# EAGLE design fju project (EAGLE 9.4.2)
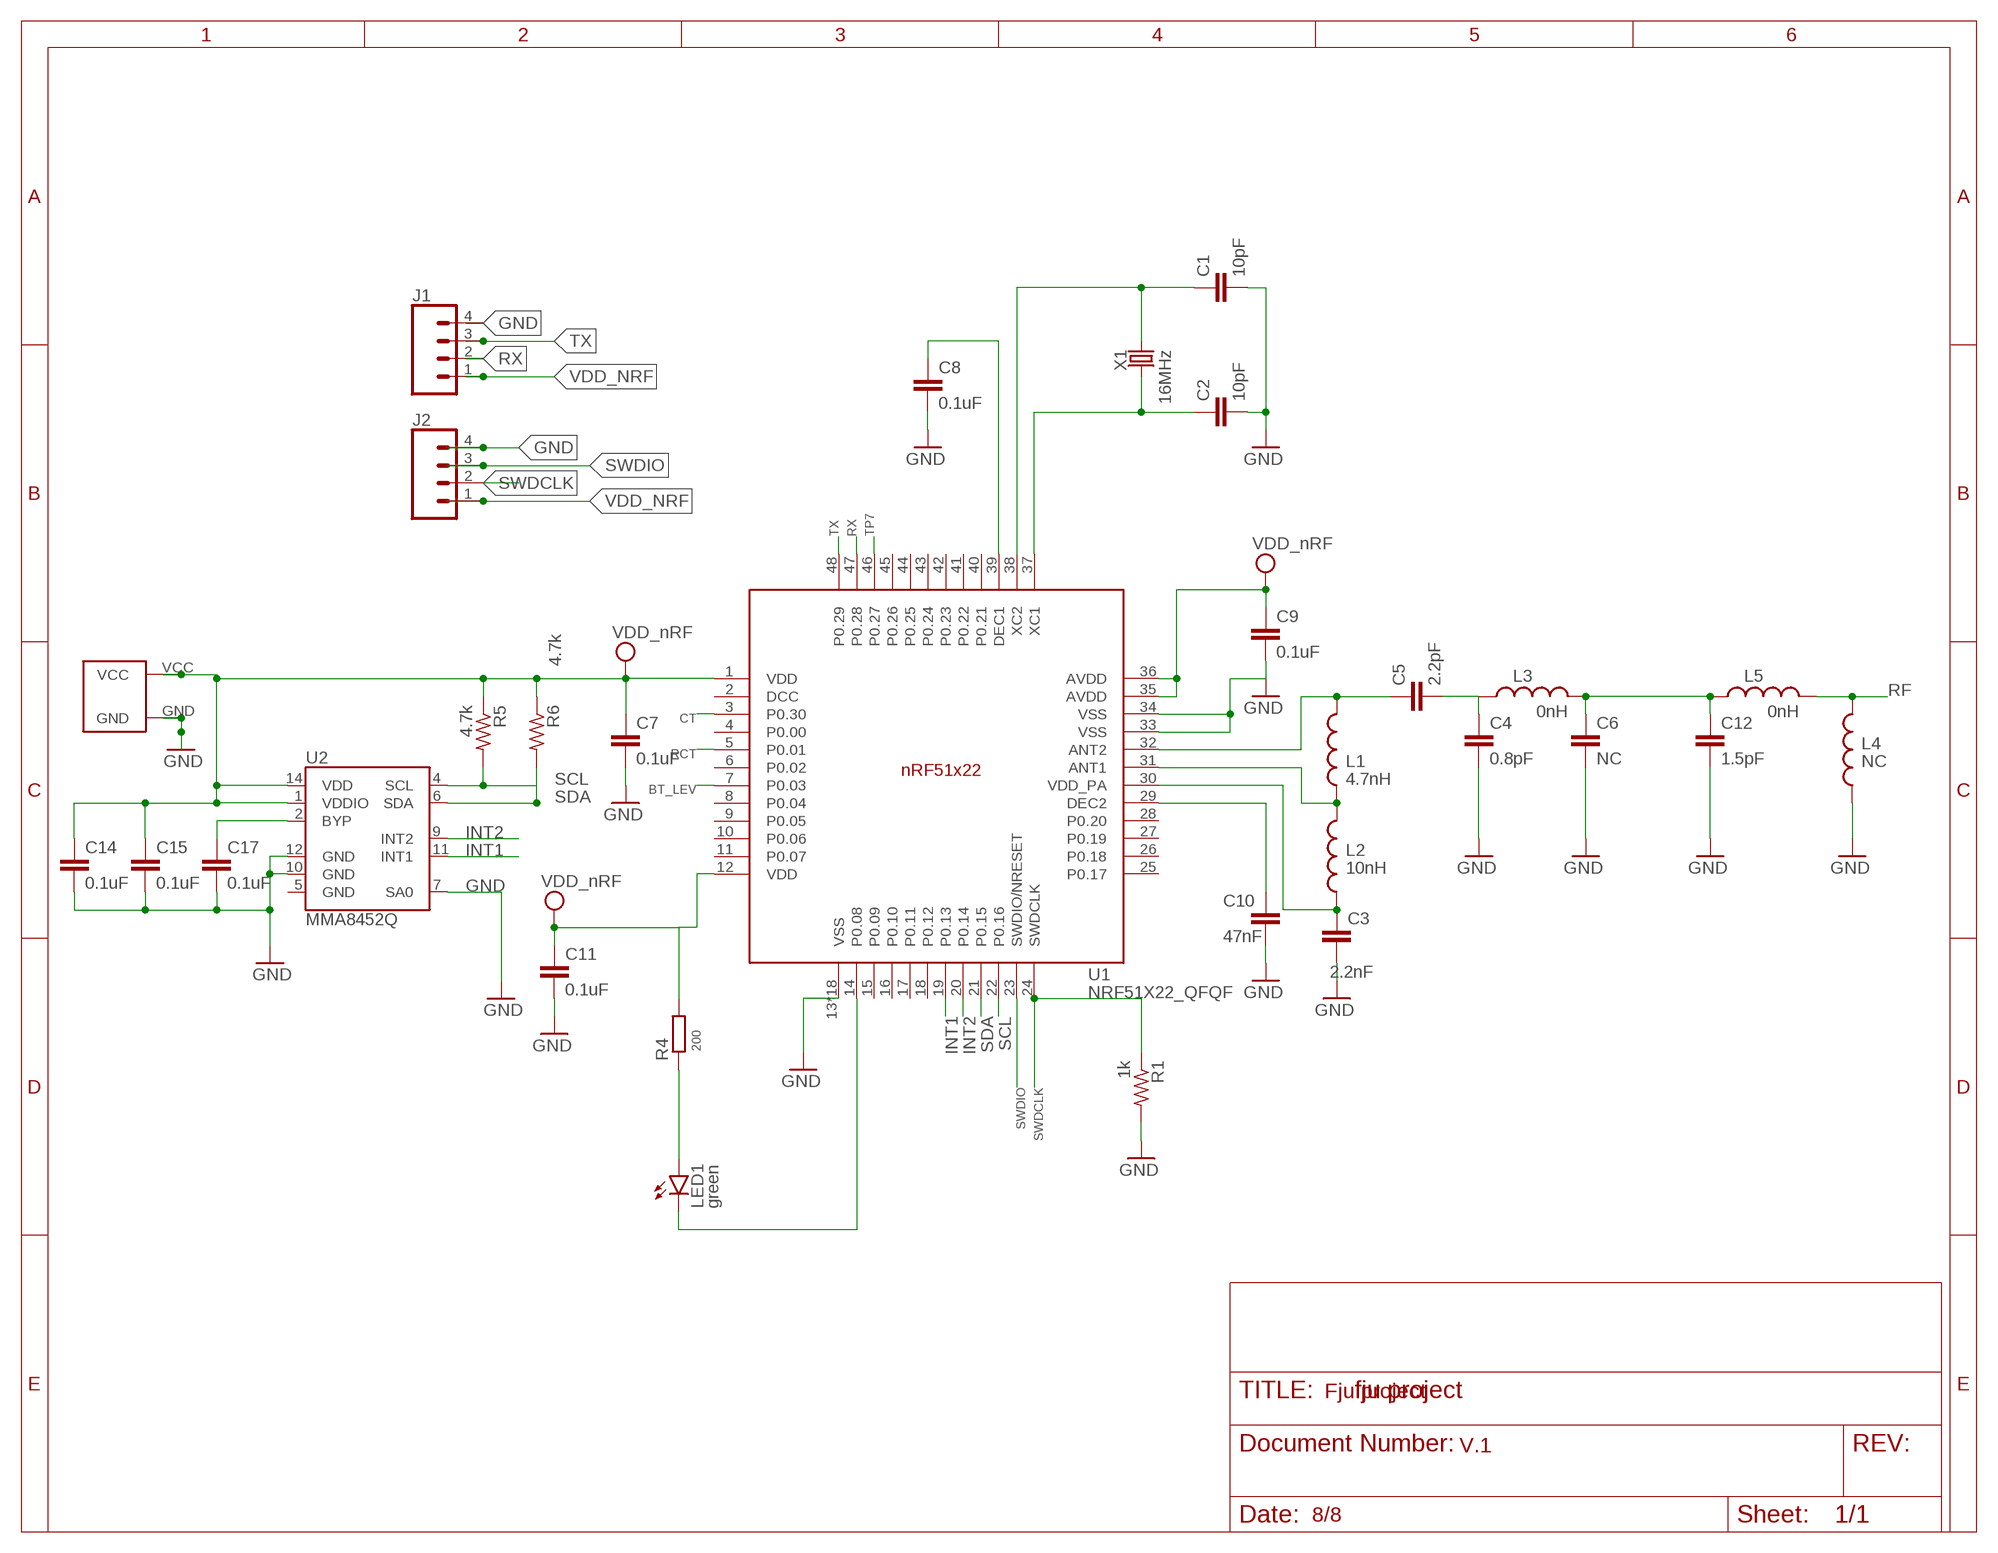
[diagram p0: schematic, sheet 1]

## Parts
C1  10pF  CAPACITOR_0402_N  [RESC0402_N]
C2  10pF  CAPACITOR_0402_N  [RESC0402_N]
C3  2.2nF  CAPACITOR_0402_N  [RESC0402_N]
C4  0.8pF  CAPACITOR_0402_N  [RESC0402_N]
C5  2.2pF  CAPACITOR_0402_N  [RESC0402_N]
C6  NC  CAPACITOR_0402_N  [RESC0402_N]
C7  0.1uF  CAPACITOR_0402_N  [RESC0402_N]
C8  0.1uF  CAPACITOR_0402_N  [RESC0402_N]
C9  0.1uF  CAPACITOR_0402_N  [RESC0402_N]
C10  47nF  CAPACITOR_0402_N  [RESC0402_N]
C11  0.1uF  CAPACITOR_0402_N  [RESC0402_N]
C12  1.5pF  CAPACITOR_0402_N  [RESC0402_N]
C14  0.1uF  CAPACITOR_0402_N  [RESC0402_N]
C15  0.1uF  CAPACITOR_0402_N  [RESC0402_N]
C17  0.1uF  CAPACITOR_0402_N  [RESC0402_N]
J1  CONN_04  [1X04]
J2  CONN_04  [1X04]
L1  4.7nH  INDUCTOR_0402_N  [RESC0402_N]
L2  10nH  INDUCTOR_0402_N  [RESC0402_N]
L3  0nH  INDUCTOR_0402_N  [RESC0402_N]
L4  NC  INDUCTOR_0402_N  [RESC0402_N]
L5  0nH  INDUCTOR_0402_N  [RESC0402_N]
LED1  green  LEDSML0603  [SML0603]
R1  1k  R-US_R0402  [R0402]
R4  200  RESISTOR_0402_N  [RESC0402_N]
R5  4.7k  R-US_R0402  [R0402]
R6  4.7k  R-US_R0402  [R0402]
U1  NRF51X22_QFQF  [QFN40P600X600X90-48_N]
U2  MMA8452Q  [QFN-16_0.5MM]
U$1  CR2032  [CR2032-20MM]
X1  16MHz  KX-6  [2.5X2.0_KX-6]

## Nets
BT_LEV: U1.7(P0.03)
BYP: C17.1 U2.2(BYP)
CT: U1.3(P0.30)
GND: C1.2 C2.2 C3.2 C4.2 C6.2 C7.2 C8.2 C9.2 C10.2 C11.2 C12.2 C14.2 C15.2 C17.2 J1.4 J2.4 L4.1 R1.2 U1.13(VSS) U1.33(VSS) U1.34(VSS) U1.PAD(VSS) U1.PAD@VIA01(VSS) U1.PAD@VIA02(VSS) U1.PAD@VIA03(VSS) U1.PAD@VIA04(VSS) U1.PAD@VIA05(VSS) U1.PAD@VIA06(VSS) U1.PAD@VIA07(VSS) U1.PAD@VIA08(VSS) U1.PAD@VIA09(VSS) U1.PAD@VIA10(VSS) U1.PAD@VIA11(VSS) U1.PAD@VIA12(VSS) U1.PAD@VIA13(VSS) U1.PAD@VIA14(VSS) U1.PAD@VIA15(VSS) U1.PAD@VIA16(VSS) U2.7(SA0) U2.10(GND) U2.12(GND) U$1.GND
INT1: U1.19(P0.13) U2.11(INT1)
INT2: U1.20(P0.14) U2.9(INT2)
N$1: L1.1 L2.2 U1.31(ANT1)
N$2: LED1.A R4.1
N$3: C1.1 U1.38(XC2) X1.1
N$4: C4.1 C5.2 L3.1
N$5: C10.1 U1.29(DEC2)
N$6: C8.1 U1.39(DEC1)
N$7: C3.1 L2.1 U1.30(VDD_PA)
N$9: C5.1 L1.2 U1.32(ANT2)
N$10: C6.1 C12.1 L3.2 L5.1
P0.08: LED1.C U1.14(P0.08)
P0.18: U1.46(P0.27)
RCT: U1.5(P0.01)
RF: L4.2 L5.2
RX: J1.2 U1.47(P0.28)
SCL: R5.2 U1.22(P0.16) U2.4(SCL)
SDA: R6.2 U1.21(P0.15) U2.6(SDA)
SWDCLK: J2.2 R1.1 U1.24(SWDCLK)
SWDIO: J2.3 U1.23(SWDIO/NRESET)
TX: J1.3 U1.48(P0.29)
VDD_NRF: C7.1 C9.1 C11.1 C14.1 C15.1 J1.1 J2.1 R4.2 R5.1 R6.1 U1.1(VDD) U1.12(VDD) U1.35(AVDD) U1.36(AVDD) U2.1(VDDIO) U2.14(VDD) U$1.VCC ; supply symbol labelled VDD_nRF
X1: C2.1 U1.37(XC1) X1.3
Unconnected: U1.4(P0.00) U1.6(P0.02) U1.8(P0.04) U1.9(P0.05) U1.10(P0.06) U1.11(P0.07) U1.15(P0.09) U1.16(P0.10) U1.17(P0.11) U1.18(P0.12) U1.25(P0.17) U1.26(P0.18) U1.27(P0.19) U1.28(P0.20) U1.40(P0.21) U1.41(P0.22) U1.42(P0.23) U1.43(P0.24) U1.44(P0.25) U1.45(P0.26) U2.5(GND)

## Notes on the sheet
- Fju project
- V.1
- 8/8

## Power pins joined to a net without a drawn wire
DCC: U1.2(DCC)

## Library data of the parts
C1-C12 C14 C15 C17 = Nordic_nRF:CAPACITOR: Generic chip capacitor; OC_FARNELL: unknown
J1 J2 = SparkFun-Connectors:CONN_04: Multi connection point. Often used as Generic Header-pin footprint for 0.1 inch spaced/style header connections On any of the 0.1 inch spaced packages, you can populate with these: Break Away Headers - Straight <https://www.sparkfun.com/products/116> (PRT-00116) Break Away Male Headers - Right Angle <https://www.sparkfun.com/products/553> (PRT-00553) Female Headers <https://www.sparkfun.com/products/115> (PRT-00115) Break Away Headers - Machine Pin <https://www.sparkfun.com/products/117> (PRT-00117) Break Away Female Headers - Swiss Machine Pin <https://www.sparkfun.com/products/743> (PRT-00743) For SCREWTERMINALS and SPRING TERMINALS visit here: Screw Terimnals on SparkFun.com <https://www.sparkfun.com/search/results?term=Screw+Terminals> (5mm/3.5mm/2.54mm spacing) This device is also useful as a general connection point to wire up your design to another part of your project. Our various solder wires solder well into these plated through hole pads. Hook-Up Wire - Assortment (Stranded, 22 AWG) <https://www.sparkfun.com/products/11375> (PRT-11375) Hook-Up Wire - Assortment (Solid Core, 22 AWG) <https://www.sparkfun.com/products/11367> (PRT-11367) View the entire wire category on our website here <https://www.sparkfun.com/categories/141> Special notes: Molex polarized connector foot print use with SKU : PRT-08231 with associated crimp pins and housings. 1MM SMD Version SKU: PRT-10208; PROD_ID: CONN-09696
L1 = Nordic_nRF:INDUCTOR: Generic chip inductor; MF: BOURNS; MPN: CE201210-4N7J.; OC_FARNELL: 2821535; OC_NEWARK: unknown
L2-L5 = Nordic_nRF:INDUCTOR: Generic chip inductor; OC_FARNELL: unknown; OC_NEWARK: unknown
LED1 = led:LED: LED OSRAM: - CHIPLED LG R971, LG N971, LY N971, LG Q971, LY Q971, LO R971, LY R971 LH N974, LH R974 LS Q976, LO Q976, LY Q976 LO Q996 - Hyper CHIPLED LW Q18S LB Q993, LB Q99A, LB R99A - SideLED LS A670, LO A670, LY A670, LG A670, LP A670 LB A673, LV A673, LT A673, LW A673 LH A674 LY A675 LS A676, LA A676, LO A676, LY A676, LW A676 LS A679, LY A679, LG A679 - Hyper Micro SIDELED® LS Y876, LA Y876, LO Y876, LY Y876 LT Y87S - SmartLED LW L88C, LW L88S LB L89C, LB L89S, LG L890 LS L89K, LO L89K, LY L89K LS L896, LA L896, LO L896, LY L896 - TOPLED LS T670, LO T670, LY T670, LG T670, LP T670 LSG T670, LSP T670, LSY T670, LOP T670, LYG T670 LG T671, LOG T671, LSG T671 LB T673, LV T673, LT T673, LW T673 LH T674 LS T676, LA T676, LO T676, LY T676, LB T676, LH T676, LSB T676, LW T676 LB T67C, LV T67C, LT T67C, LS T67K, LO T67K, LY T67K, LW E67C LS E67B, LA E67B, LO E67B, LY E67B, LB E67C, LV E67C, LT E67C LW T67C LS T679, LY T679, LG T679 LS T770, LO T770, LY T770, LG T770, LP T770 LB T773, LV T773, LT T773, LW T773 LH T774 LS E675, LA E675, LY E675, LS T675 LS T776, LA T776, LO T776, LY T776, LB T776 LHGB T686 LT T68C, LB T68C - Hyper Mini TOPLED® LB M676 - Mini TOPLED Santana® LG M470 LS M47K, LO M47K, LY M47K Source: http://www.osram.convergy.de LUXEON: - LUMILED® LXK2-PW12-R00, LXK2-PW12-S00, LXK2-PW14-U00, LXK2-PW14-V00 LXK2-PM12-R00, LXK2-PM12-S00, LXK2-PM14-U00 LXK2-PE12-Q00, LXK2-PE12-R00, LXK2-PE12-S00, LXK2-PE14-T00, LXK2-PE14-U00 LXK2-PB12-K00, LXK2-PB12-L00, LXK2-PB12-M00, LXK2-PB14-N00, LXK2-PB14-P00, LXK2-PB14-Q00 LXK2-PR12-L00, LXK2-PR12-M00, LXK2-PR14-Q00, LXK2-PR14-R00 LXK2-PD12-Q00, LXK2-PD12-R00, LXK2-PD12-S00 LXK2-PH12-R00, LXK2-PH12-S00 LXK2-PL12-P00, LXK2-PL12-Q00, LXK2-PL12-R00 Source: www.luxeon.com KINGBRIGHT: KA-3528ASYC Source: www.kingbright.com; OC_FARNELL: unknown; OC_NEWARK: unknown
R1 R5 R6 = rcl:R-US_: RESISTOR, American symbol; OC_FARNELL: unknown; SPICEPREFIX: R
R4 = Nordic_misc:RESISTOR: Generic chip resistor
U1 = Nordic_nRF:NRF51X22_QF: nRF51x22 For devices: nRF51422 nRF51822 Features Single chip, highly flexible, 2.4 GHz multi-protocol device 32-bit ARM Cortex M0 CPU core 256kB/128kB flash + 32kB/16kB RAM Supports Bluetooth low energy protocol stacks Thread safe and run-time protected Event driven API On air compatible with nRF24L series 3 data rates (2Mbps/1Mbps/250kbps) +4dBm output power -93dBm sensitivity, Bluetooth low energy PPI system for maximum power-efficient applications and code simplification Flexible power management system with automatic power management of each peripheral Configurable I/O mapping for analog and digital I/O Applications Mobile phone accessories Wearables Beacons Rezence wireless charging monitoring PC peripherals Consumer Electronics (CE) remote controls Proximity/Alert sensors Smart Home Sports, fitness and healthcare sensors Smart RF tags Toys and electronic games Intelligent domestic appliances Industrial and commercial sensors Lighting; OC_FARNELL: unknown; OC_NEWARK: unknown
U2 = SparkFun:MMA8452Q: MMA8452Q 3-Axis, 12/8-bit Digital Accelerometer Supply Voltage: 1.6-3.6V Range: +/- 2g, 4g, 8g Interface: I2C, 12-bit and 8-bit ODR: 1.56 Hz - 800 Hz Package: QFN-16 http://cache.freescale.com/files/sensors/doc/data_sheet/MMA8452Q.pdf; OC_FARNELL: unknown; OC_NEWARK: unknown
U$1 = cr2032v2:CR2032
X1 = crystal-geyer_V1_0:KX: Quartz Crystals (MHz) SMD: KX - Serie Model Size l/w/h [mm] Frequency Range Frequency Stability Temp. Range [°C] Load Capacitance AECQ 200 availabel Datasheet KX-4 KX-5 KX-6 KX-7 KX-9A KX-9B KX-12A KX-12B KX-13 KX-20 KX-K KX-KS 1.6/1.2/0.3 2.0/1.6/0.45 2.5/2.0/0.55 3.2/2.5/0.8 5.0/3.2/1.0 5.0/3.2/1.1 6.0/3.5/1.1 6.0/3.5/1.0 7.0/5.0 /1.3 11.6/5.5/1.6 12.3/4.5/4.2 12.3/4.5/3.2 24.0 ~ 80.0 MHz 16.0 ~ 80.0 MHz 12.0 ~ 80.0 MHz 8.0 ~ 60.0 MHz 7,68 ~ 300,0 MHz 8,0 ~ 50,0 MHz 8,0 ~ 150,0 MHz 8,0 ~ 50,0 MHz 6,0 ~ 160,0 MHz 3,579 ~ 25,0 MHz 3,579 ~ 70,0 MHz 3,579 ~ 70,0 MHz ±10 … ±50ppm ±10 … ±50ppm ±10 … ±50ppm ±10 … ±50ppm ±10 … ±50ppm ±10 … ±50ppm ±10 … ±50ppm ±10 … ±50ppm ±10 … ±50ppm ±50ppm ±10 … ±50ppm ±10 … ±50ppm (*) -40°C …+85°C (*) -40°C …+125°C (*) -40°C …+125°C (*) -40°C …+125°C (*) -40°C …+105°C (*) -40°C …+105°C (*) -40°C …+125°C (*) -40°C …+105°C (*) -40°C …+105°C (*) -40°C …+105°C (*) -40°C …+85°C (*) -40°C …+85°C 8, 8…16 8, 8…16 10, 8…16 12, 7…20 16, 10…20 16, 10…20 16, 10…20 16, 12…20 16, 12…20 16, 12…20 16, 12…30 16, 12…30 - yes yes yes - - - - - - - - KX-4.pdf <http://www.geyer-electronic.de/uploads/tx_userartikelfrequenz/GEYER-KX-4.pdf> KX-5.pdf <http://www.geyer-electronic.de/uploads/tx_userartikelfrequenz/GEYER-KX-5.pdf> KX-6.pdf <http://www.geyer-electronic.de/uploads/tx_userartikelfrequenz/GEYER-KX-6.pdf> KX-7.pdf <http://www.geyer-electronic.de/uploads/tx_userartikelfrequenz/GEYER-KX-7.pdf> KX-9A.pdf <http://www.geyer-electronic.de/uploads/tx_userartikelfrequenz/GEYER-KX-9A.pdf> KX-9B.pdf <http://www.geyer-electronic.de/uploads/tx_userartikelfrequenz/GEYER-KX-9B.pdf> KX-12A.pdf <http://www.geyer-electronic.de/uploads/tx_userartikelfrequenz/GEYER-KX-12A.pdf> KX-12B.pdf <http://www.geyer-electronic.de/uploads/tx_userartikelfrequenz/GEYER-KX-12B.pdf> KX-13.pdf <http://www.geyer-electronic.de/uploads/tx_userartikelfrequenz/GEYER-KX-13.pdf> KX-20.pdf <http://www.geyer-electronic.de/uploads/tx_userartikelfrequenz/GEYER-KX-20.pdf> KX-K.pdf <http://www.geyer-electronic.de/uploads/tx_userartikelfrequenz/GEYER-KX-K.pdf> KX-KS.pdf <http://www.geyer-electronic.de/uploads/tx_userartikelfrequenz/GEYER-KX-KS.pdf> <http://www.geyer-electronic.de/fileadmin/template/img/logo-geyer-electronic.png> Details see: http://www.geyer-electronic.de/Frequenz-Produkte.9.0.html Created 2016-06-07, Hans Locher 2016 (C) Geyer Quartz Technology KX4,KX5,KX6,KX7,KX9A,KX9B,KX12A,KX12B,KX13,KX20,KXK,KXKS;1612;2016;2520;3225;5032;6035;7050;11655;12345;1,6x1,2;2,0x1,6;2,5x2,0;3,2x2,5;5,0x3,2;6,0x3,5;7,0x5,0;11,6x5,5;12,3x4,5;12,3x4,5;1.6x1.2;2.0x1.6;2.5x2.0;3.2x2.5;5.0x3.2;6.0x3.5;7.0x5.0;11.6x5.5;12.3x4.5;12.3x4.5;; OC_FARNELL: unknown; OC_NEWARK: unknown

## Board
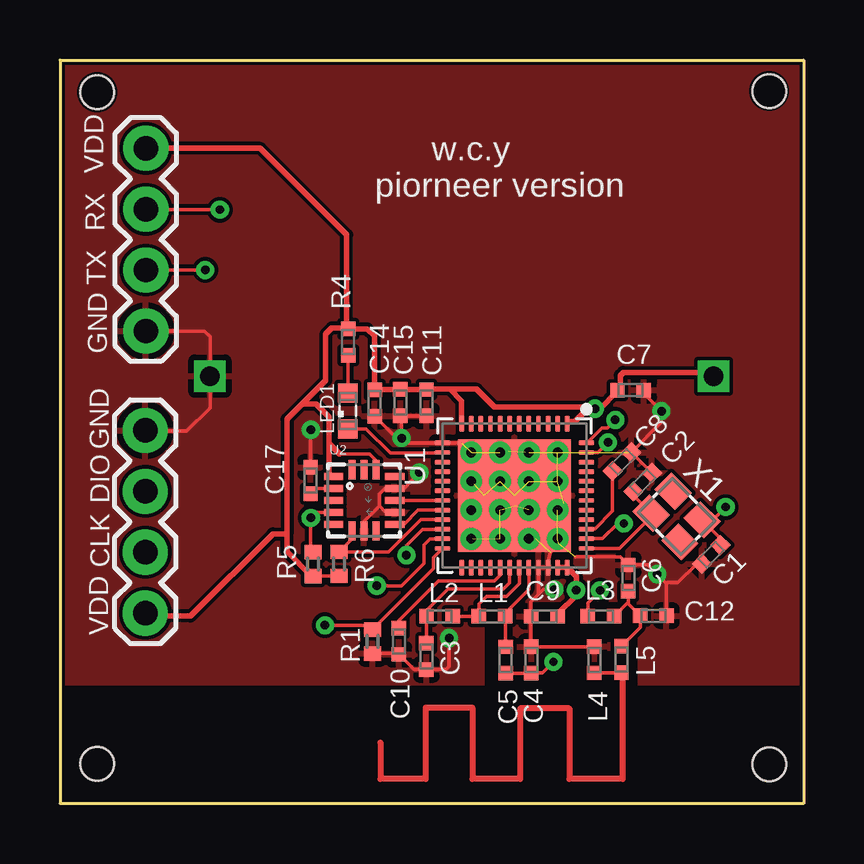
[diagram p1: board, top side]
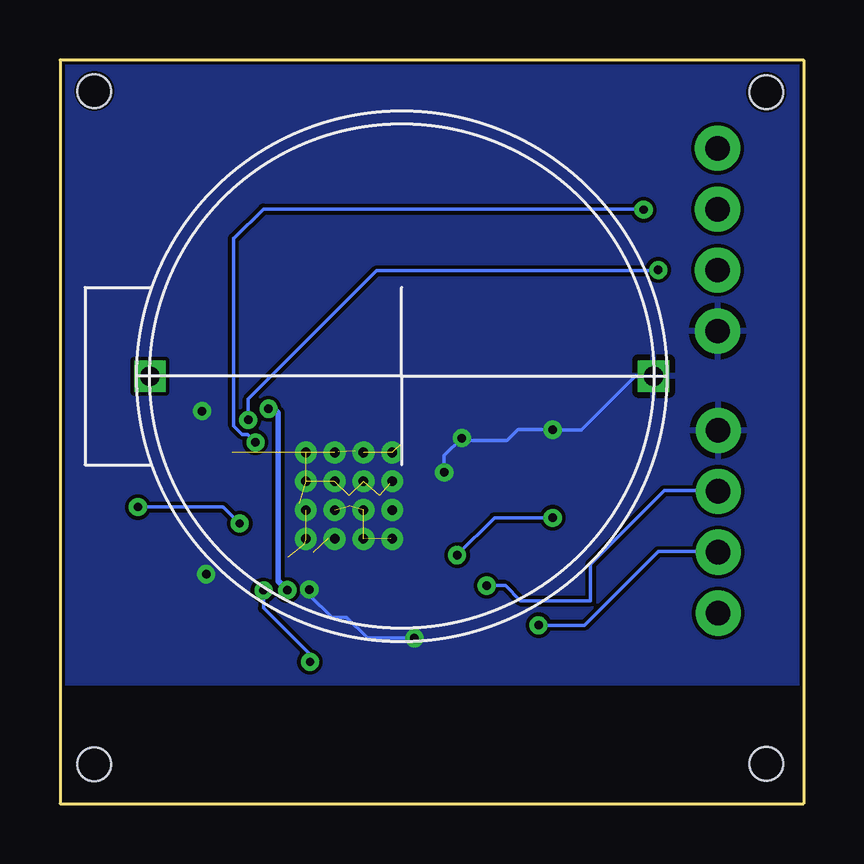
[diagram p2: board, bottom side, seen from below]

Size 31 x 31 mm. Coordinates in mm from the lower left corner, seen from the top.
Outline: 31,0 0,0 0,31 31,31 31,0
Copper layers (1*16): Top 0.035mm / dielectric 1.5mm / Bottom 0.035mm
Design rules "default *": minimum track width 6mil, minimum drill 0.35mm, track to track 6mil, track to pad 6mil, pad to pad 6mil, via to via 6mil, smd to smd 6mil, copper to edge 5mil, drill to drill 6mil, minimum pad ring 10mil, minimum via ring 8mil, stop-mask expansion 4mil, vias tented up to drill 0mil, thermal gap 10mil
Holes 1.4 mm at 1.55,1.65 1.55,29.66 29.57,29.71 29.57,1.64

### Footprints (pad centres in the part's own frame; a part is rotated, then mirrored left to right if it is on the bottom)
RESC0402_N = smd 0.6 x 0.6: 1 -0.55,0; 2 0.55,0
1X04 = drill 1.016 pad 1.88: 1 0,0; 2 2.54,0; 3 5.08,0; 4 7.62,0
SML0603 = smd 0.8 x 0.8: A 0.75,0; C -0.75,0
R0402 = smd 0.6 x 0.7: 1 -0.5,0; 2 0.5,0
QFN40P600X600X90-48_N = smd 0.65 x 0.2: 1 -3,2.2; 2 -3,1.8; 3 -3,1.4; 4 -3,1; 5 -3,0.6; 6 -3,0.2; 7 -3,-0.2; 8 -3,-0.6; 9 -3,-1; 10 -3,-1.4; 11 -3,-1.8; 12 -3,-2.2; 25 3,-2.2; 26 3,-1.8; 27 3,-1.4; 28 3,-1; 29 3,-0.6; 30 3,-0.2; 31 3,0.2; 32 3,0.6; 33 3,1; 34 3,1.4; 35 3,1.8; 36 3,2.2 | smd 0.2 x 0.65: 13 -2.2,-3; 14 -1.8,-3; 15 -1.4,-3; 16 -1,-3; 17 -0.6,-3; 18 -0.2,-3; 19 0.2,-3; 20 0.6,-3; 21 1,-3; 22 1.4,-3; 23 1.8,-3; 24 2.2,-3; 37 2.2,3; 38 1.8,3; 39 1.4,3; 40 1,3; 41 0.6,3; 42 0.2,3; 43 -0.2,3; 44 -0.6,3; 45 -1,3; 46 -1.4,3; 47 -1.8,3; 48 -2.2,3 | smd 4.7 x 4.7: PAD 0,0 | drill 0.4: PAD@VIA01 -1.8,1.8; PAD@VIA02 -1.8,0.6; PAD@VIA03 -1.8,-0.6; PAD@VIA04 -1.8,-1.8; PAD@VIA05 -0.6,1.8; PAD@VIA06 -0.6,0.6; PAD@VIA07 -0.6,-0.6; PAD@VIA08 -0.6,-1.8; PAD@VIA09 0.6,1.8; PAD@VIA10 0.6,0.6; PAD@VIA11 0.6,-0.6; PAD@VIA12 0.6,-1.8; PAD@VIA13 1.8,1.8; PAD@VIA14 1.8,0.6; PAD@VIA15 1.8,-0.6; PAD@VIA16 1.8,-1.8
QFN-16_0.5MM = smd 0.8 x 0.3: 1 -1.275,1; 2 -1.275,0.5; 3 -1.275,0; 4 -1.275,-0.5; 5 -1.275,-1; 9 1.275,-1; 10 1.275,-0.5; 11 1.275,0; 12 1.275,0.5; 13 1.275,1 | smd 0.3 x 0.8: 6 -0.5,-1.275; 7 0,-1.275; 8 0.5,-1.275; 14 0.5,1.275; 15 0,1.275; 16 -0.5,1.275
CR2032-20MM = drill 0.8 square: GND 0,10.5; VCC 0,-10.5
2.5X2.0_KX-6 = smd 1.2 x 1: 1 -0.85,-0.65; 2 0.85,-0.65; 3 0.85,0.65; 4 -0.85,0.65

### Placement (x,y rotation side)
C1  27.15,10.38 225 top
C2  24.29,13.4 45 top
C3  15.28,6.14 270 top
C4  19.65,5.99 90 top
C5  18.57,5.98 270 top
C6  23.69,9.4 90 top
C7  23.79,17.23 0 top
C8  23.43,14.25 45 top
C9  20.2,7.8 180 top
C10  14.13,6.77 270 top
C11  15.28,16.71 270 top
C12  24.74,7.83 0 top
C14  13.12,16.7 270 top
C15  14.19,16.72 270 top
C17  10.45,13.47 90 top
J1  3.58,27.32 270 top
J2  3.56,7.94 90 top
L1  18.01,7.81 0 top
L2  15.83,7.81 0 top
L3  22.56,7.81 0 top
L4  22.27,6 270 top
L5  23.41,6.01 270 top
LED1  12,16.37 90 top
R1  13.03,6.76 270 top
R4  12.01,19.24 90 top
R5  10.56,9.99 90 top
R6  11.64,9.99 90 top
U1  18.95,12.84 270 top
U2  12.68,12.64 0 top
U$1  16.75,17.82 270 bottom
X1  25.7,11.97 135 top

### Tracks (layer width: path | path; a pad name or v marks a point on that pad's centre or on a via)
BYP
  Top 0.152: C17.1 10.67,13.14 U2.2
GND  (via drill 0.35)  (20 unrouted)
  Top 0.152: 20.8,10.82 20.45,10.47 20.35,10.08 U1.34 U1.33 19.95,8.71 | 17.2,11.05 U1.PAD@VIA16 | 19.82,11.06 U1.PAD@VIA14 | 17.68,12.85 U1.PAD@VIA12 | 17.25,13.32 U1.PAD@VIA08 | U1.PAD 18.95,12.4 | U1.PAD@VIA09 21.01,12.5 | 18.69,14.7 U1.PAD@VIA03 | 19.41,14.66 U1.PAD@VIA02 19.57,14.7 | C10.2 14.09,6.26 R1.2 | C10.2 14.31,6.39 | 21.5,10.29 23.36,10.29 C6.2 24.52,9.95 v24.9,9.56 25.29,9.17 | v10.46,15.59 10.45,15.57 C17.2 | 25.29,9.17 C12.2 25.38,7.83 | C14.2 14.04,15.24 v14.25,15.24 | v14.25,15.24 14.25,16.11 C15.2 C11.2 | v14.25,15.24 14.44,15.04 U1.13 16.75,15.04 | 13.33,12.4 13.58,12.14 U2.10 | 13.33,12.4 13.33,12.9 13.6,13.18 13.92,13.18 U2.12 14.34,13.14 14.98,13.78 v14.98,13.81 | C10.2 14.76,5.59 C3.2 16.09,5.59 16.22,5.72 v16.22,6.9 | C4.2 19.64,6.54 C4.2 | C4.2 L4.1 | C7.2 24.34,17.1 v25.08,16.36 25.08,15.9 C8.2 C2.2 | C1.2 26.55,9.99 25.77,9.21 25.33,9.21 25.29,9.17 | 19.95,8.71 19.64,8.41 C9.2 C4.2 | J2.4 3.59,15.53 5.29,15.53 6.25,16.49 U$1.GND 6.25,19.46 6,19.71 3.59,19.71 J1.4 | 19.95,8.71 20.16,8.92 v20.61,8.92 | U2.7 12.68,11.75 13.33,12.4
  Bottom 0.152: v14.98,13.81 14.98,14.5 v14.25,15.24 14.14,15.13 12.37,15.13 11.91,15.59 v10.46,15.59 10.44,15.56 9.26,15.56 7.01,17.82 U$1.GND | v16.22,6.9 18.19,6.9 19.05,7.76 19.66,7.76 20.61,8.71 v20.61,8.92
  pour Top: 0,31 31,31 31,5 0,5
  pour Bottom: 0,31 31,31 31,5 0,5
  cutout Top: 20.07,4.89 20.07,6.16 22.1,6.16 22.1,4.89
  cutout Top: 18.16,6.16 19.43,6.16 19.43,5.53 18.16,5.53
  cutout Top: 22.61,6.29 23.88,6.29 23.88,5.65 22.61,5.65
  cutout Top: 20.95,8.32 23.88,8.32 23.88,6.79 19.68,6.79 19.68,8.32
  cutout Top: 19.94,6.41 21.97,6.41 21.97,6.16 19.94,6.16
  cutout Top: 19.94,6.67 21.97,6.67 21.97,6.92 19.94,6.92
  cutout Top: 24,4.89 24,6.92 23.5,6.92 23.5,4.89
  cutout Top: 17.78,8.45 17.78,4.89 18.8,4.89 18.8,8.45
INT1
  Top 0.152: U1.19 U2.11
INT2
  Top 0.152: U1.20 14.94,12.24 14.34,11.64 U2.9
N$1
  Top 0.152: L1.1 | 16.39,7.82 L2.2 L1.1 | U1.31 19.15,9.17 18.62,8.65 17.78,8.65 17.46,8.33 L1.1
N$2
  Top 0.152: R4.1 12.01,17.14 LED1.A
N$3  (via drill 0.35)
  Top 0.152: v23.51,11.68 23.25,11.68 22.62,11.04 U1.38 | v27.75,12.36 27.21,11.83 X1.1 27.54,11.05 C1.1
  Bottom 0.152: v27.75,12.36 24.19,12.36 v23.51,11.68
N$4  (via drill 0.35)
  Top 0.152: L3.1 22.01,8.36 22.51,8.86 v22.51,8.89 | C5.2 C4.1 20.12,5.45 v20.57,5.91
  Bottom 0.152: v20.57,5.91 20.57,6.21 22.51,8.15 v22.51,8.89
N$5
  Top 0.152: C10.1 14.13,7.63 15.78,9.27 18.12,9.27 18.35,9.51 U1.29
N$6
  Top 0.152: C8.1 23.04,12.2 22.3,11.46 21.98,11.46 21.97,11.46 U1.39
N$7
  Top 0.152: C3.1 L2.1 15.28,8.05 16.18,8.95 18.5,8.95 18.75,9.2 U1.30
N$9
  Top 0.152: L1.2 18.56,7.94 | 18.56,7.94 18.56,8.01 | L1.2 18.56,7.69 | U1.32 19.55,8.92 18.56,7.94 | L1.2 18.56,6.54 C5.1
N$10
  Top 0.152: L3.2 23.69,8.4 C6.1 23.69,8.33 C12.1 24.19,7.34 L5.1
P0.08
  Top 0.152: U1.14 15.92,14.61 13.77,14.61 12.76,15.62 LED1.C
RF
  Top 0.152: L4.2 L5.2 23.45,5.47
  Top 0.254: 23.45,5.47 23.45,1.02 21.23,1.02 21.23,3.97 19.18,3.97 19.18,1.02 17.2,1.02 17.2,3.99 15.24,3.99 15.24,1.02 13.36,1.02 13.36,2.55
RX  (via drill 0.35)
  Top 0.152: U1.47 22.43,14.64 v22.85,15.06 | v6.67,24.76 3.6,24.76 J1.2
  Bottom 0.152: v22.85,15.06 23.18,15.39 23.4,15.39 23.76,15.74 23.76,23.56 23.76,23.57 23.74,23.57 22.52,24.78 6.69,24.78 v6.67,24.76
SCL  (via drill 0.35)
  Top 0.152: U1.22 15.12,11.44 14.44,10.76 v14.44,10.36 | R5.2 10.46,10.59 v10.46,11.91 10.69,12.14 U2.4
  Bottom 0.152: v10.46,11.91 12.89,11.91 v14.44,10.36
SDA
  Top 0.152: U1.21 15.05,11.84 13.7,10.49 R6.2 | 12.17,10.49 R6.2 | U2.6 12.18,11.03 R6.2
SWDCLK  (via drill 0.35)
  Top 0.152: R1.1 13.03,7.29 | U1.24 15.58,10.27 15.58,9.8 R1.1 | v11.05,7.43 12.86,7.43 R1.1
  Bottom 0.152: v11.05,7.43 9.14,7.43 6.06,10.51 3.58,10.51 J2.2
SWDIO  (via drill 0.35)
  Top 0.152: U1.23 15.42,11.04 15.17,10.79 15.17,10.01 14.24,9.08 v13.21,9.08
  Bottom 0.152: v13.21,9.08 v13.2,9.09 12.44,9.09 11.8,8.45 8.88,8.45 8.88,9.98 5.81,13.05 3.58,13.05 J2.3
TX  (via drill 0.35)
  Top 0.152: v23.15,16 22.82,15.66 22.6,15.66 21.97,15.04 U1.48 | v6.06,22.24 J1.3
  Bottom 0.152: v23.15,16 23.15,16.86 17.79,22.22 6.08,22.22 v6.06,22.24
VDD_NRF  (via drill 0.35)
  Top 0.152: 21.18,9.83 21.18,9.84 U1.36 | U2.1 11.23,13.64 | C14.1 13.13,17.27 | C11.1 15.3,17.28 | 23.24,17.19 C7.1 23.36,17.35 | R6.1 R5.1 10.48,9.49 | C9.1 20.75,7.9 | U2.14 13.18,14.31 12.91,14.58 11.65,14.58 | 22.23,16.53 v22.31,16.46 | R4.2 11.95,19.73 11.95,19.82
  Top 0.229: 13.13,17.27 C15.1 C11.1 | 16.26,17.28 17.37,17.28 18.11,16.53 22.23,16.53 | 16.26,17.28 15.3,17.28 | 23.24,17.19 22.51,16.46 v22.31,16.46 22,16.46 21.48,15.94 21.25,15.94 U1.1 | 9.46,11.25 9.46,16.02 10.1,16.66 | 11.23,15 11.23,16.12 10.69,16.66 10.1,16.66 | 11.23,15 11.23,13.64 | 20.75,7.9 21.52,8.68 v21.52,8.9 21.52,9.46 U1.36 U1.35 | 11.23,15 11.65,14.58 | 23.36,17.35 23.36,17.85 23.48,17.98 27.09,17.98 U$1.VCC | 9.46,11.25 8.88,11.25 5.45,7.81 3.68,7.81 J2.1 | 16.26,17.28 16.75,16.78 U1.12 | C14.1 13.12,19.48 12.81,19.79 R4.2 | 10.1,16.66 11.08,17.64 11.08,19.57 11.33,19.82 11.95,19.82 11.95,23.72 8.35,27.32 J1.1 | 9.46,11.25 9.46,10.5 10.48,9.49
  Bottom 0.229: v22.31,16.46 22.08,16.46 21.9,16.29 21.9,9.28 v21.52,8.9
X1
  Top 0.152: C2.1 23.91,12.85 X1.3 24.64,11.96 24.04,11.35 23.32,10.64 U1.37

### Text on the board
tNames: VDD | RX | w.c.y / piorneer version | TX | GND | GND | DIO | CLK | VDD